# Altium schematic sheet 海关全向本体电路板V3_电机驱动管理.SchDoc
size A3
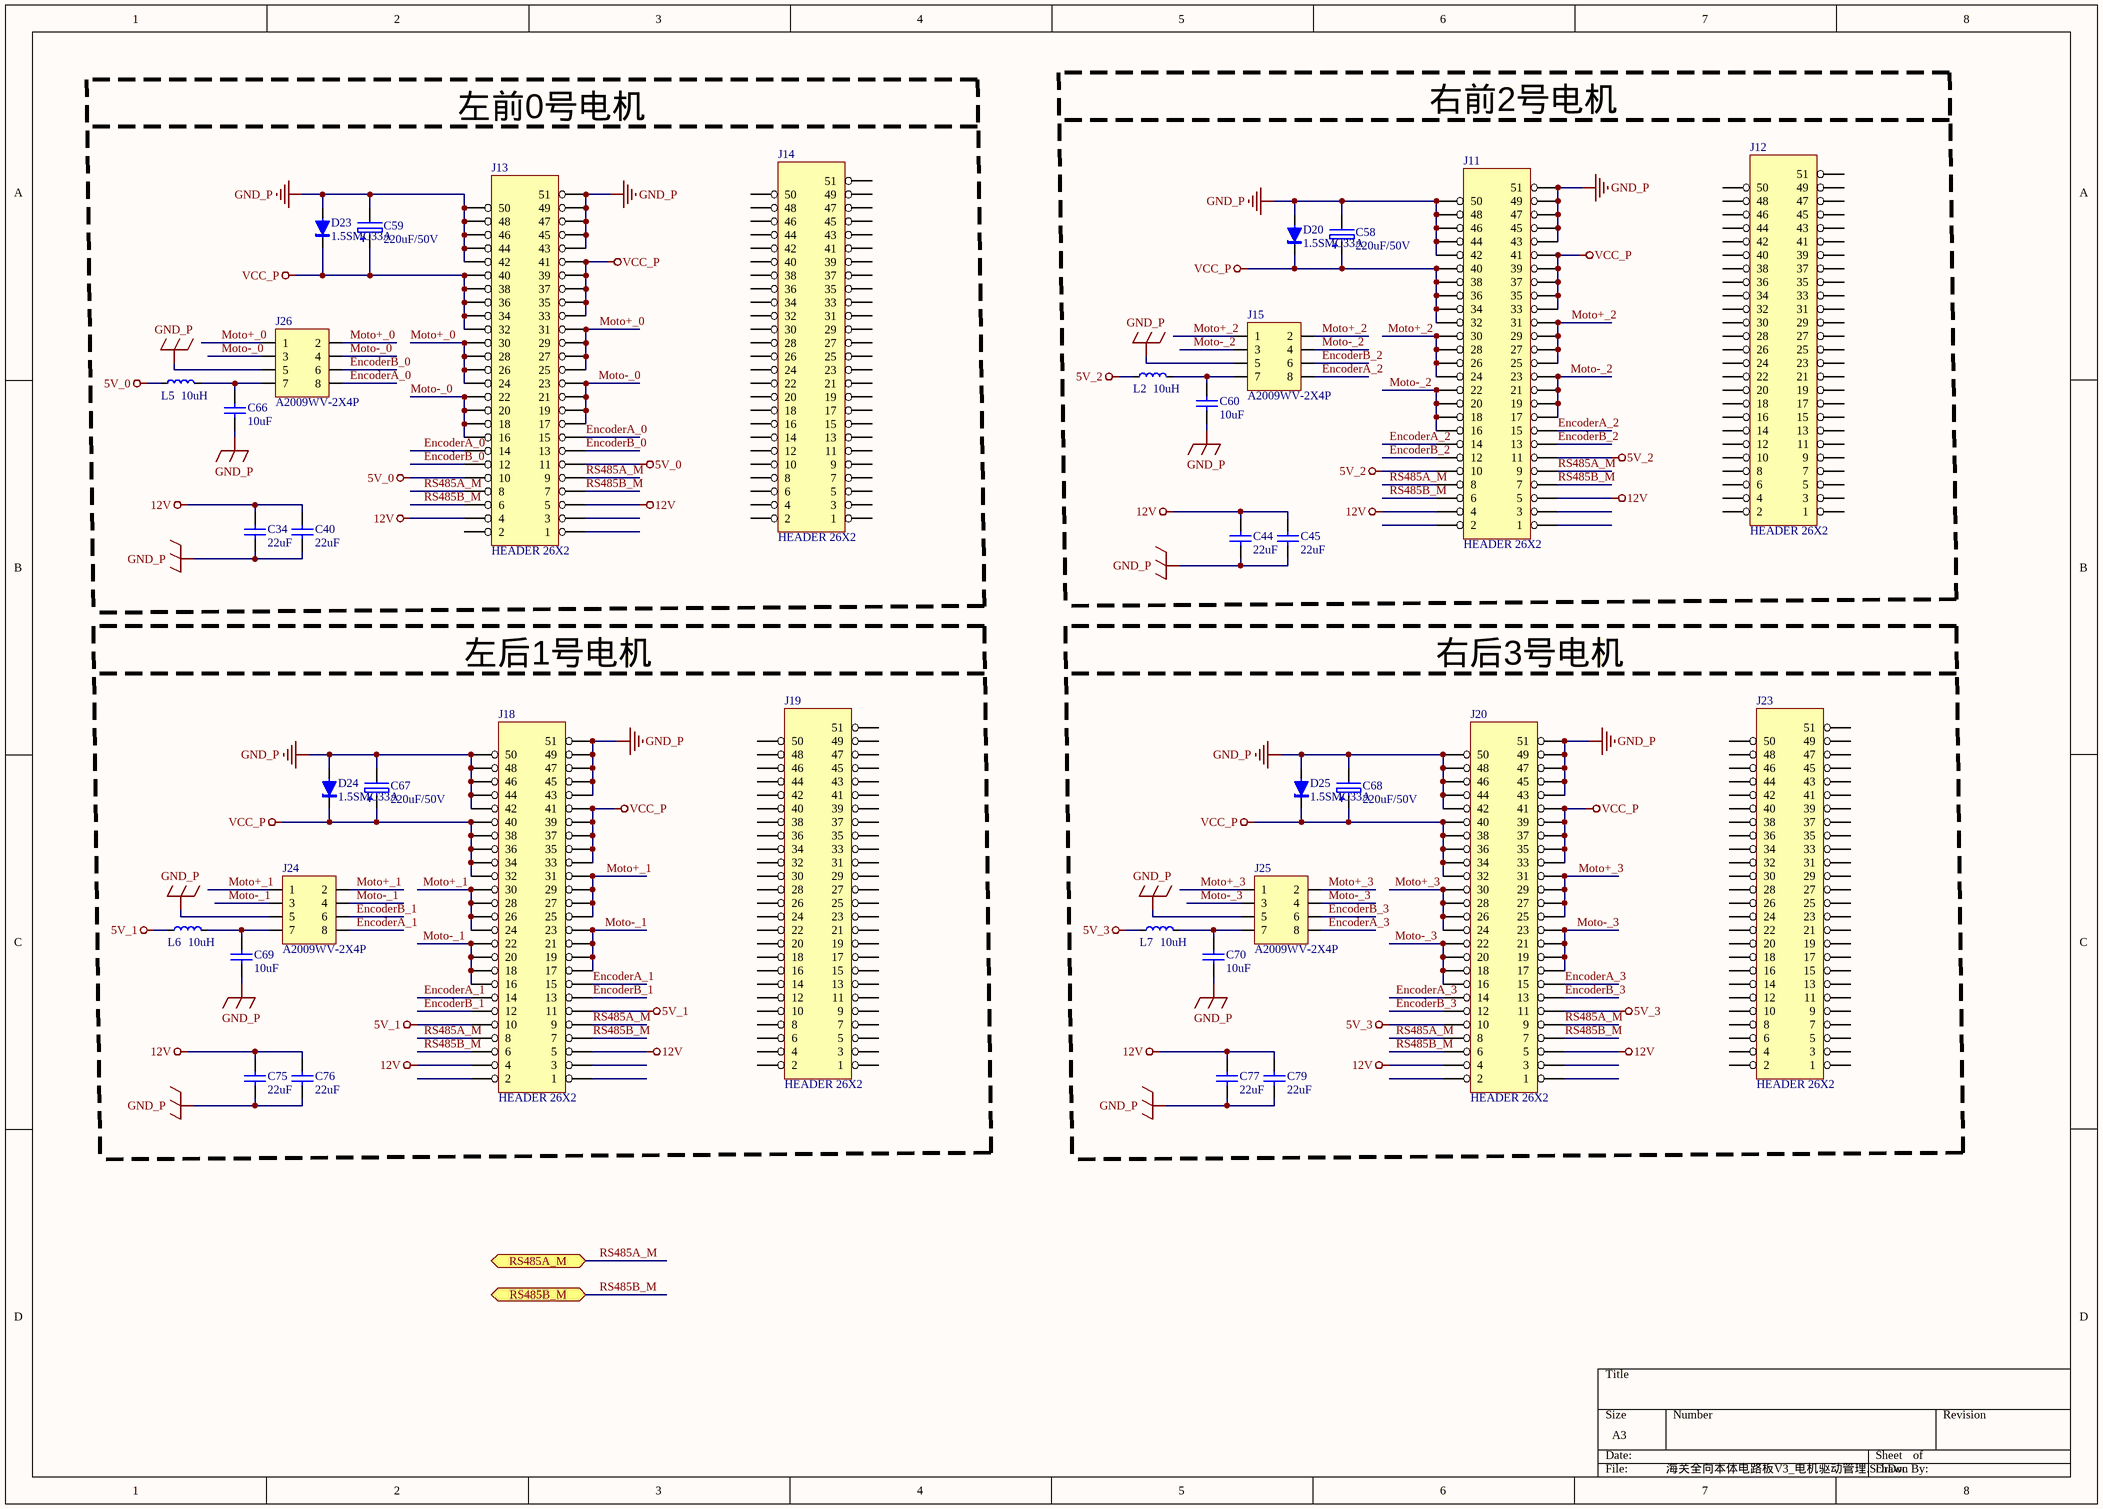
[diagram p0: 海关全向本体电路板V3_电机驱动管理.SchDoc]

## Parts
C34  22uF  [C1206-S]
C40  22uF  [C1206-S]
C44  22uF  [C1206-S]
C45  22uF  [C1206-S]
C58  220uF/50V  [CAPPR-10X10-SM]
C59  220uF/50V  [CAPPR-10X10-SM]
C60  10uF  [C0603-S]
C66  10uF  [C0603-S]
C67  220uF/50V  [CAPPR-10X10-SM]
C68  220uF/50V  [CAPPR-10X10-SM]
C69  10uF  [C0603-S]
C70  10uF  [C0603-S]
C75  22uF  [C1206-S]
C76  22uF  [C1206-S]
C77  22uF  [C1206-S]
C79  22uF  [C1206-S]
D20  1.5SMC33A  [SMC-S]
D23  1.5SMC33A  [SMC-S]
D24  1.5SMC33A  [SMC-S]
D25  1.5SMC33A  [SMC-S]
J11  HEADER 26X2  [DF9-51P-1V]
J12  HEADER 26X2  [DF9-51P-1V]
J13  HEADER 26X2  [DF9-51P-1V]
J14  HEADER 26X2  [DF9-51P-1V]
J15  A2009WV-2X4P  [A2009WV-2X4P]
J18  HEADER 26X2  [DF9-51P-1V]
J19  HEADER 26X2  [DF9-51P-1V]
J20  HEADER 26X2  [DF9-51P-1V]
J23  HEADER 26X2  [DF9-51P-1V]
J24  A2009WV-2X4P  [A2009WV-2X4P]
J25  A2009WV-2X4P  [A2009WV-2X4P]
J26  A2009WV-2X4P  [A2009WV-2X4P]
L2  10uH  [L0805-C]
L5  10uH  [L0805-C]
L6  10uH  [L0805-C]
L7  10uH  [L0805-C]

## Blocks framed on the sheet
左前0号电机: C34 C40 C59 C66 D23 J13 J14 J26 L5
右前2号电机: C44 C45 C58 C60 D20 J11 J12 J15 L2
左后1号电机: C67 C69 C75 C76 D24 J18 J19 J24 L6
右后3号电机: C68 C70 C77 C79 D25 J20 J23 J25 L7

## Ports
RS485A_M (bidir), RS485B_M (bidir)

## Nets
5V_0: J13.10 J13.11 L5.1
5V_1: J18.10 J18.11 L6.1
5V_2: J11.10 J11.11 L2.1
5V_3: J20.10 J20.11 L7.1
12V: C34.1 C40.1 C44.1 C45.1 C75.1 C76.1 C77.1 C79.1 J11.4 J11.5 J13.4 J13.5 J18.4 J18.5 J20.4 J20.5
GND_P: C34.2 C40.2 C44.2 C45.2 C58.2 C59.2 C60.2 C66.2 C67.2 C68.2 C69.2 C70.2 C75.2 C76.2 C77.2 C79.2 D20.1(A) D23.1(A) D24.1(A) D25.1(A) J11.42 J11.43 J11.44 J11.45 J11.46 J11.47 J11.48 J11.49 J11.50 J11.51 J13.42 J13.43 J13.44 J13.45 J13.46 J13.47 J13.48 J13.49 J13.50 J13.51 J15.5 J18.42 J18.43 J18.44 J18.45 J18.46 J18.47 J18.48 J18.49 J18.50 J18.51 J20.42 J20.43 J20.44 J20.45 J20.46 J20.47 J20.48 J20.49 J20.50 J20.51 J24.5 J25.5 J26.5
VCC_P: C58.1 C59.1 C67.1 C68.1 D20.2(K) D23.2(K) D24.2(K) D25.2(K) J11.32 J11.33 J11.34 J11.35 J11.36 J11.37 J11.38 J11.39 J11.40 J11.41 J13.32 J13.33 J13.34 J13.35 J13.36 J13.37 J13.38 J13.39 J13.40 J13.41 J18.32 J18.33 J18.34 J18.35 J18.36 J18.37 J18.38 J18.39 J18.40 J18.41 J20.32 J20.33 J20.34 J20.35 J20.36 J20.37 J20.38 J20.39 J20.40 J20.41
EncoderA_0: J13.14 J13.15 J26.8
EncoderA_1: J18.14 J18.15 J24.8
EncoderA_2: J11.14 J11.15 J15.8
EncoderA_3: J20.14 J20.15 J25.8
EncoderB_0: J13.12 J13.13 J26.6
EncoderB_1: J18.12 J18.13 J24.6
EncoderB_2: J11.12 J11.13 J15.6
EncoderB_3: J20.12 J20.13 J25.6
Moto+_0: J13.24 J13.25 J13.26 J13.27 J13.28 J13.29 J13.30 J13.31 J26.1 J26.2
Moto+_1: J18.24 J18.25 J18.26 J18.27 J18.28 J18.29 J18.30 J18.31 J24.1 J24.2
Moto+_2: J11.24 J11.25 J11.26 J11.27 J11.28 J11.29 J11.30 J11.31 J15.1 J15.2
Moto+_3: J20.24 J20.25 J20.26 J20.27 J20.28 J20.29 J20.30 J20.31 J25.1 J25.2
Moto-_0: J13.16 J13.17 J13.18 J13.19 J13.20 J13.21 J13.22 J13.23 J26.3 J26.4
Moto-_1: J18.16 J18.17 J18.18 J18.19 J18.20 J18.21 J18.22 J18.23 J24.3 J24.4
Moto-_2: J11.16 J11.17 J11.18 J11.19 J11.20 J11.21 J11.22 J11.23 J15.3 J15.4
Moto-_3: J20.16 J20.17 J20.18 J20.19 J20.20 J20.21 J20.22 J20.23 J25.3 J25.4
RS485A_M: J11.8 J11.9 J13.8 J13.9 J18.8 J18.9 J20.8 J20.9 ; port RS485A_M
RS485B_M: J11.6 J11.7 J13.6 J13.7 J18.6 J18.7 J20.6 J20.7 ; port RS485B_M
NetC60_1: C60.1 J15.7 L2.2
NetC66_1: C66.1 J26.7 L5.2
NetC69_1: C69.1 J24.7 L6.2
NetC70_1: C70.1 J25.7 L7.2

Not connected (* = marked no-connect by the designer): J11 1 2 3; J12 1 2 3 4 5 6 7 8 9 10 11 12 13 14 15 16 17 18 19 20 21 22 23 24 25 26 27 28 29 30 31 32 33 34 35 36 37 38 39 40 41 42 43 44 45 46 47 48 49 50 51; J13 1 2 3; J14 1 2 3 4 5 6 7 8 9 10 11 12 13 14 15 16 17 18 19 20 21 22 23 24 25 26 27 28 29 30 31 32 33 34 35 36 37 38 39 40 41 42 43 44 45 46 47 48 49 50 51; J18 1 2 3; J19 1 2 3 4 5 6 7 8 9 10 11 12 13 14 15 16 17 18 19 20 21 22 23 24 25 26 27 28 29 30 31 32 33 34 35 36 37 38 39 40 41 42 43 44 45 46 47 48 49 50 51; J20 1 2 3; J23 1 2 3 4 5 6 7 8 9 10 11 12 13 14 15 16 17 18 19 20 21 22 23 24 25 26 27 28 29 30 31 32 33 34 35 36 37 38 39 40 41 42 43 44 45 46 47 48 49 50 51

## Library data of the parts
C34 C40 C44 C45 C60 C66 C69 C70 C75-C77 C79 = CAP: Published: 8-Jun-2000; LatestRevisionDate: 17-Jul-2002; LatestRevisionNote: Re-released for DXP Platform.; PackageReference: RAD-0.3; Publisher: Altium Limited
  C34 C40 C44 C45 C75-C77 C79: Value: 22uF
  C60 C66 C69 C70: Value: 10uF
C58 C59 C67 C68 = ELECTRO: Electrolytic Capacitor
D20 D23-D25 = DIODE-ZENER: Small Signal Zener Diodes
J11-J14 J18-J20 J23 = HEADER 35X2_1
J15 J24-J26 = HEADER2X4
L2 L5-L7 = INDUCTOR: Code_IEC: 1005; Published: 8-Jun-2000; LatestRevisionDate: 17-Jul-2002; LatestRevisionNote: Re-released for DXP Platform.; PackageReference: 0402-A; Publisher: Altium Limited; Code_JEITA: 0402; Value: 10uH